# EasyEDA Pro project ProPrj_DRV8701电机双驱.epro

# Schematic Schematic1
Create Date: 2023-02-28; Page Name: P1; Project Name: DRV8701电机双驱; Schematic Name: Schematic1; Update Date: 2023-03-22; Company: 嘉立创EDA; Page Size: A4; Version: V1.0
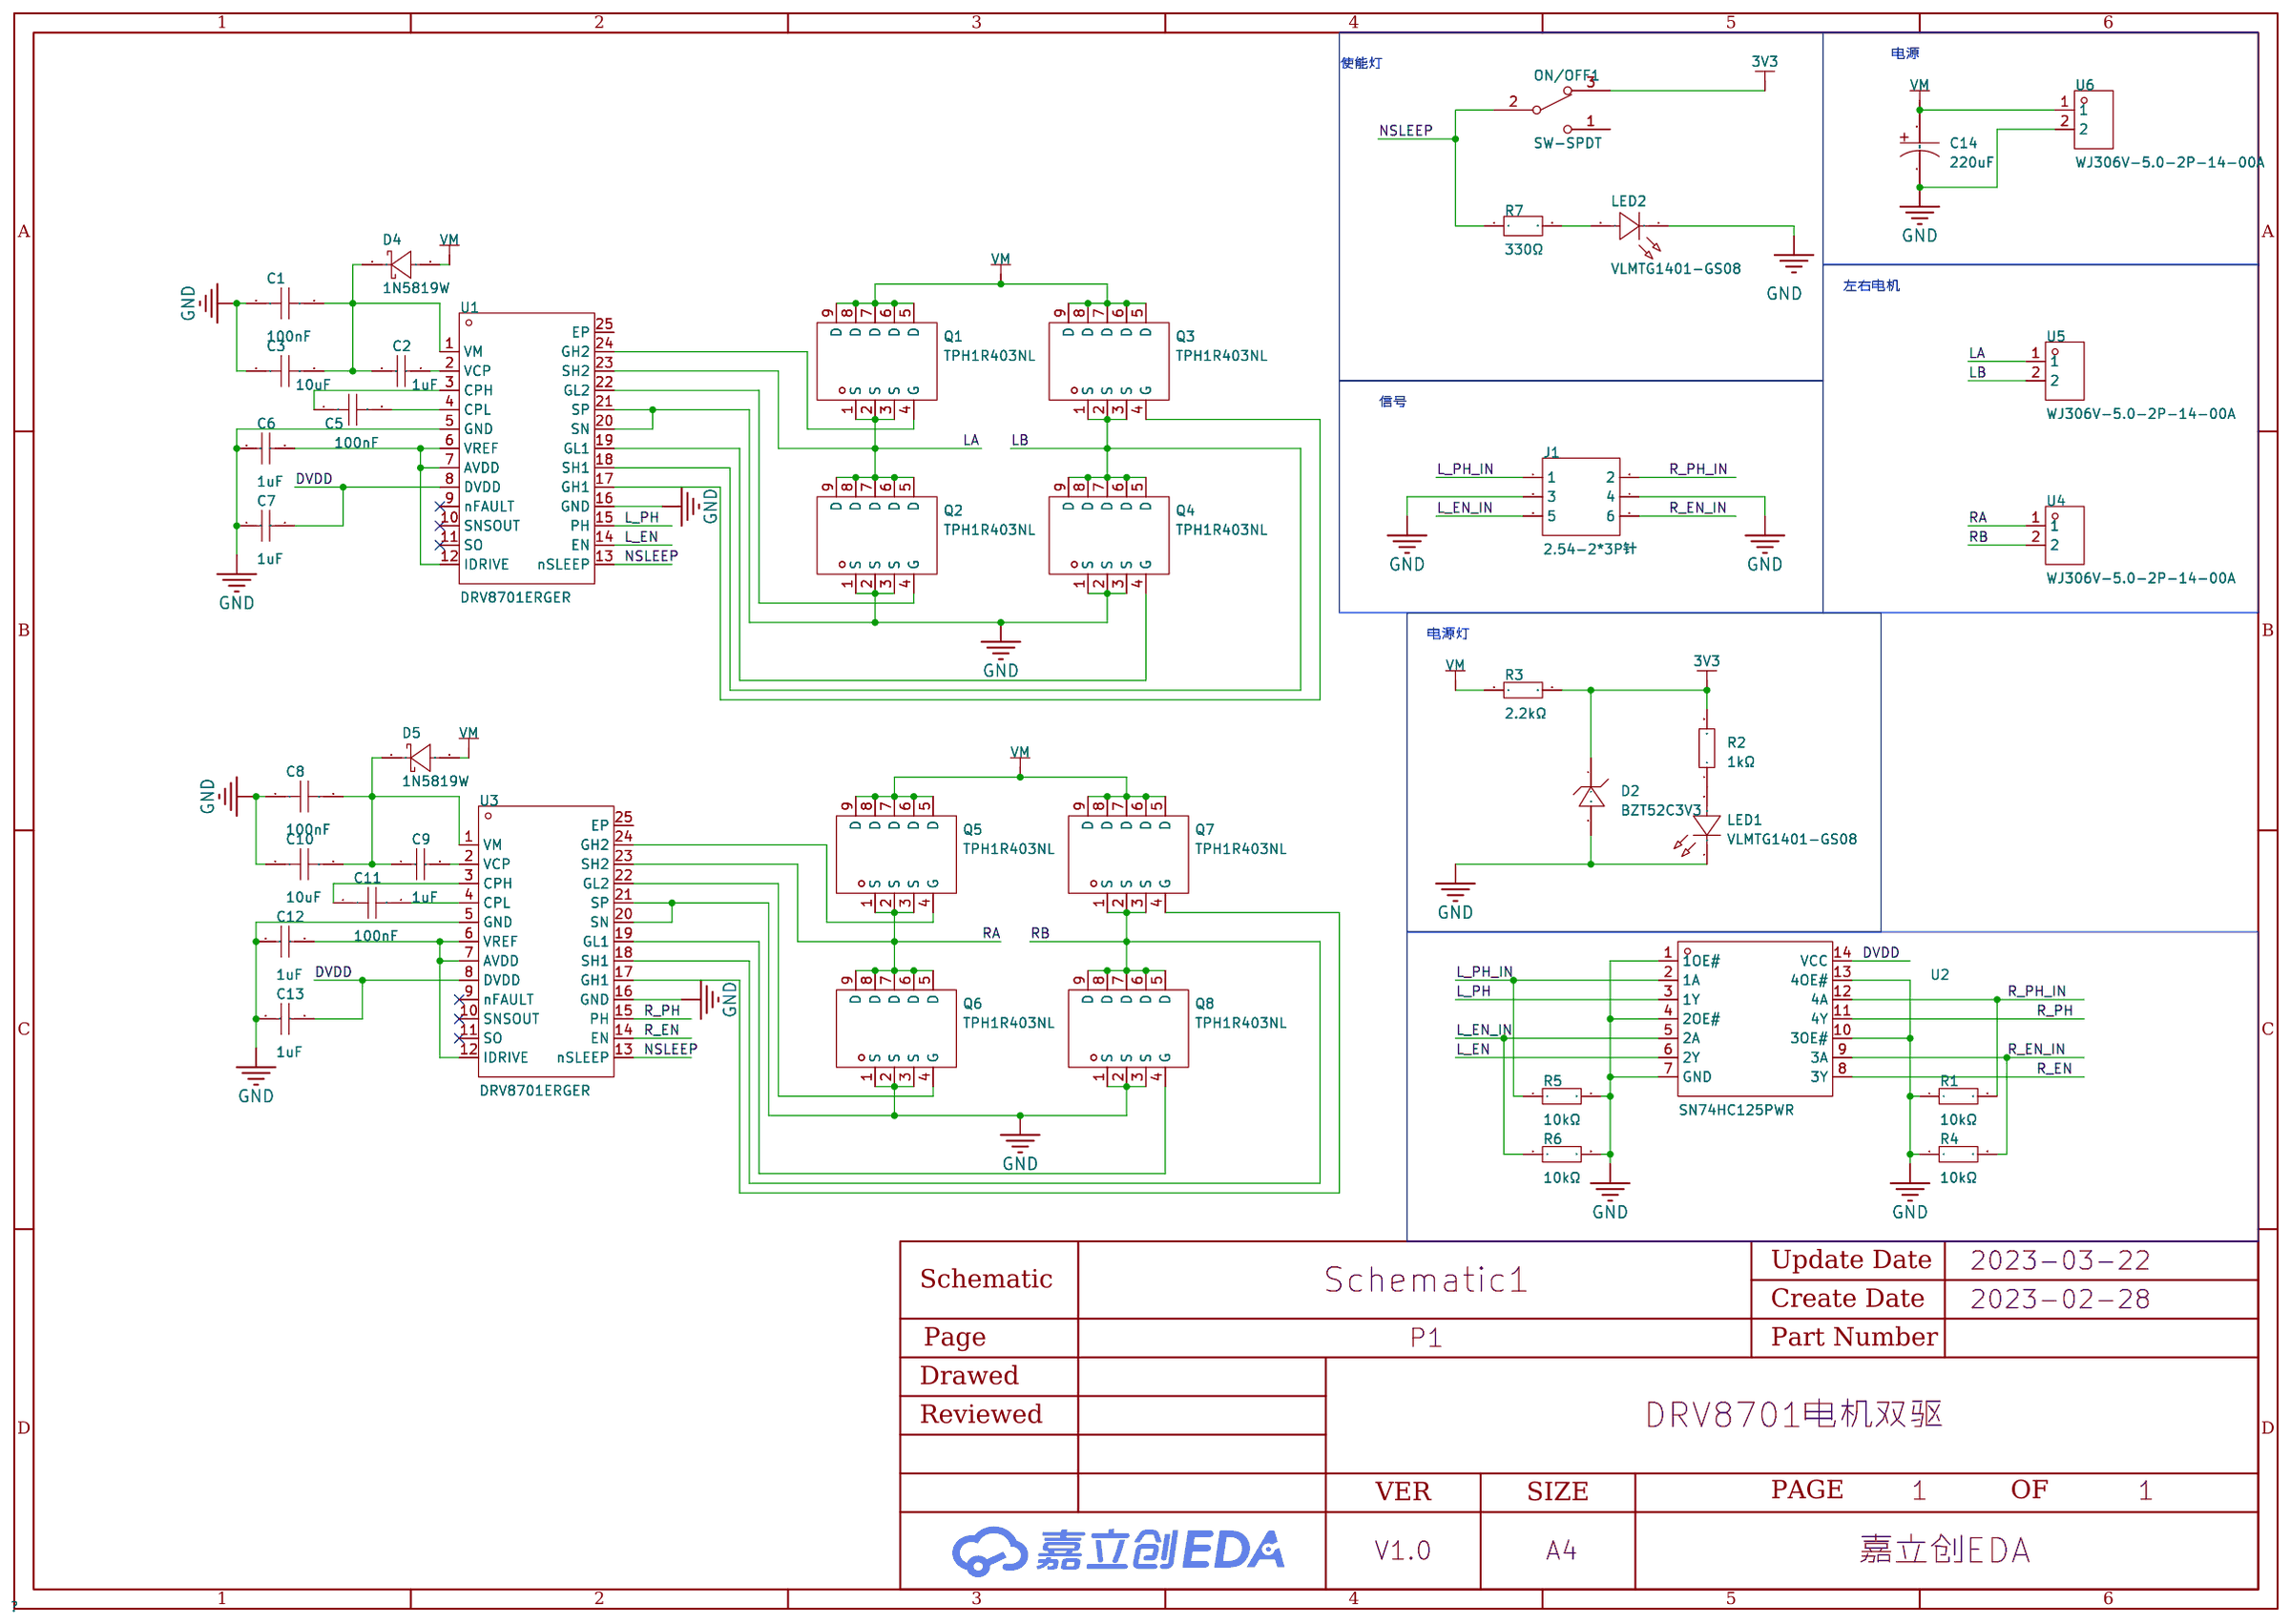
[diagram p0: schematic sheet]

## Parts
C1  100nF  [C0603]
C2  1uF  [C0603]
C3  10uF  [C0805]
C5  100nF  [C0603]
C6  1uF  [C0603]
C7  1uF  [C0603]
C8  100nF  [C0603]
C9  1uF  [C0603]
C10  10uF  [C0805]
C11  100nF  [C0603]
C12  1uF  [C0603]
C13  1uF  [C0603]
C14  220uF  [CAP-SMD_BD8.0-L8.3-W8.3-FD]
D2  BZT52C3V3  [SOD-123_L2.7-W1.6-LS3.7-RD-1]
D4  1N5819W  [SOD-123_L2.7-W1.6-LS3.7-RD-1]
D5  1N5819W  [SOD-123_L2.7-W1.6-LS3.7-RD-1]
J1  2.54-2*3P针  [HDR-TH_6P-P2.54-V-M-R2-C3-S2.54-1]
LED1  VLMTG1401-GS08  [LED0603-RD_GREEN]
LED2  VLMTG1401-GS08  [LED0603-RD_GREEN]
ON/OFF1  SW-SPDT  [SS12D10]
Q1  TPH1R403NL  [DSOP-8_L5.0-W5.0-P1.27-LS6.0-BL-EP]
Q2  TPH1R403NL  [DSOP-8_L5.0-W5.0-P1.27-LS6.0-BL-EP]
Q3  TPH1R403NL  [DSOP-8_L5.0-W5.0-P1.27-LS6.0-BL-EP]
Q4  TPH1R403NL  [DSOP-8_L5.0-W5.0-P1.27-LS6.0-BL-EP]
Q5  TPH1R403NL  [DSOP-8_L5.0-W5.0-P1.27-LS6.0-BL-EP]
Q6  TPH1R403NL  [DSOP-8_L5.0-W5.0-P1.27-LS6.0-BL-EP]
Q7  TPH1R403NL  [DSOP-8_L5.0-W5.0-P1.27-LS6.0-BL-EP]
Q8  TPH1R403NL  [DSOP-8_L5.0-W5.0-P1.27-LS6.0-BL-EP]
R1  10kΩ  [R0603]
R2  1kΩ  [R0603]
R3  2.2kΩ  [R0603]
R4  10kΩ  [R0603]
R5  10kΩ  [R0603]
R6  10kΩ  [R0603]
R7  330Ω  [R0603]
U1  DRV8701ERGER  [VQFN-24_L4.0-W4.0-P0.50-BL-EP2.5]
U2  SN74HC125PWR  [TSSOP-14_L5.0-W4.4-P0.65-LS6.5-BL]
U3  DRV8701ERGER  [VQFN-24_L4.0-W4.0-P0.50-BL-EP2.5]
U4  WJ306V-5.0-2P-14-00A  [CONN-TH_2P-P5.00_L7.6-W10.0]
U5  WJ306V-5.0-2P-14-00A  [CONN-TH_2P-P5.00_L7.6-W10.0]
U6  WJ306V-5.0-2P-14-00A  [CONN-TH_2P-P5.00_L7.6-W10.0]

## Library data of the parts
C1 C5 C8 C11 = CL10B104KB8NNNC: 容值:100nF;精度:±10%;额定电压:50V;材质(温度系数):X7R;; LCSC Part Name: 100nF ±10% 50V; Supplier Part: C1591; Manufacturer: SAMSUNG(三星); Supplier Footprint: 0603; JLCPCB Part Class: Extended Part; Datasheet: https://atta.szlcsc.com/upload/public/pdf/source/20160103/1457707680512.pdf; Supplier: LCSC; Tolerance: ±10%; Voltage Rated: 50V; Temperature Coefficient: X7R
C2 C6 C7 C9 C12 C13 = CL10A105KB8NNNC: 容值:1uF;精度:±10%;额定电压:50V;材质(温度系数):X5R;; LCSC Part Name: 1uF ±10% 50V; Supplier Part: C15849; Manufacturer: SAMSUNG(三星); Supplier Footprint: 0603; JLCPCB Part Class: Basic Part; Datasheet: https://atta.szlcsc.com/upload/public/pdf/source/20160103/1457707679084.pdf; Supplier: LCSC; Tolerance: ±10%; Voltage Rated: 50V; Temperature Coefficient: X5R
C3 C10 = CL21A106KBYQNNE: 容值:10uF;精度:±10%;额定电压:50V;材质(温度系数):X5R;; LCSC Part Name: 10uF ±10% 50V; Supplier Part: C2932476; Manufacturer: SAMSUNG(三星); Supplier Footprint: 0805; JLCPCB Part Class: Extended Part; Datasheet: https://atta.szlcsc.com/upload/public/pdf/source/20211217/EA547804C3DC63CB0E92325AB8B6CF61.pdf; Supplier: LCSC; Tolerance: ±10%; Voltage Rated: 50V; Temperature Coefficient: X5R
C14 = EEE1EA221UP: 容值:220uF;精度:±20%;额定电压:25V;电容体直径:8mm;电容体长度:10.2mm;纹波电流:-;等效串联电阻:-;工作寿命:2000hrs@85℃;工作温度:-40℃~+85℃;; LCSC Part Name: 220uF ±20% 25V; Supplier Part: C178503; Manufacturer: PANASONIC(松下); Supplier Footprint: SMD,8x10.2mm; JLCPCB Part Class: Extended Part; Datasheet: https://atta.szlcsc.com/upload/public/pdf/source/20180621/C178503_55EE803068FDE8BD2A71DBD57C7B88C8.pdf; Supplier: LCSC; Tolerance: ±20%; Rated Voltage: 25V; φD: 8mm; L: 10.2mm; Lifetime @ Temp: 2000hrs@85℃; Operating Temperature: -40℃~+85℃
D2 = BZT52C3V3: 二极管配置:-;稳压值(标称值):3.3V;稳压值(范围):3.3V~3.5V;功率:500mW;反向电流(Ir):5uA@1V;阻抗(Zzt):95Ω;; LCSC Part Name: 3.3V 500mW; Supplier Part: C2891770; Manufacturer: YONGYUTAI(永裕泰); Supplier Footprint: SOD-123; JLCPCB Part Class: Extended Part; Datasheet: https://atta.szlcsc.com/upload/public/pdf/source/20210901/8FC2376A01E96D0346FF8B134DC7A446.pdf; Supplier: LCSC; Zener Voltage (Nom): 3.3V; Zener Voltage (Range): 3.3V~3.5V; Power Dissipation: 500mW; Reverse Leakage Current (Ir): 5uA@1V; Zener Impedance (Zzt): 95Ω
D4 D5 = 1N5819W: 二极管配置:-;直流反向耐压(Vr):40V;平均整流电流(Io):1A;正向压降(Vf):900mV@3A;反向电流(Ir):1mA@40V;; LCSC Part Name: 40V 1A 900mV@3A; Supplier Part: C2905650; Manufacturer: TECH PUBLIC(台舟); Supplier Footprint: SOD-123; JLCPCB Part Class: Extended Part; Datasheet: https://atta.szlcsc.com/upload/public/pdf/source/20211020/7FEA34DA99E5285CBA3CC87767B82BE7.pdf; Supplier: LCSC; Reverse Voltage (Vr): 40V; Average Rectified Current (Io): 1A; Forward Voltage (Vf@If): 900mV@3A; Reverse Leakage Current (Ir): 1mA@40V
J1 = 2.54-2*3P针: 排数:双排;总PIN位数:6;间距:2.54mm;插针结构:-;行距:-;安装类型:直插;圆针/方针:-;额定电流:-;额定电压:-;配合针长度:-;塑高:-;触头材质:-;触头镀层:-;颜色:黑色;; LCSC Part Name: 2.54mm 直插; Supplier Part: C65114; Manufacturer: BOOMELE(博穆精密); Supplier Footprint: 插件,P=2.54mm; JLCPCB Part Class: Extended Part; Datasheet: https://atta.szlcsc.com/upload/public/pdf/source/20221201/C605E3BE9C0F7226363017EFD1BDE852.pdf; Supplier: LCSC; Number of Rows: 双排; Number of Pins: 6; Pitch: 2.54mm; Mounting Type: 直插; Color: 黑色
LED1 LED2 = VLMTG1401-GS08: 照明颜色:-;色温 - CCT（K）:-;主波长/色坐标:-;正向电压（Vf）:-;; Supplier Part: C511604; Manufacturer: VISHAY(威世); Supplier Footprint: 0603; JLCPCB Part Class: Extended Part; Datasheet: https://atta.szlcsc.com/upload/public/pdf/source/20200413/C511604_272E80EA2E53340B96FA7453D68B4387.pdf; Supplier: LCSC
ON/OFF1 = SW-SPDT: Published: 24-Mar-1999; Publisher: Altium Limited; Price(RMB): 0.000; Origin Footprint 2: ToggleSwitch 7102; Origin Footprint 3: SS12D06; Origin Footprint 4: SS12D07VG4; Origin Footprint 5: MSK-12C02
Q1-Q8 = TPH1R403NL_C83440: 类型:N沟道;漏源电压(Vdss):30V;连续漏极电流(Id):150A;功率(Pd):64W;导通电阻(RDS(on)@Vgs,Id):1.4mΩ@10V,30A;阈值电压(Vgs(th)@Id):2.3V@500uA;; LCSC Part Name: N沟道 30V 150A; Supplier Part: C83440; Manufacturer: TOSHIBA(东芝); Supplier Footprint: DSOP-8-EP-5.0mm; JLCPCB Part Class: Extended Part; Datasheet: https://atta.szlcsc.com/upload/public/pdf/source/20170908/C83440_1504870121708958077.pdf; Supplier: LCSC; Type: N沟道; Drain Source Voltage (Vdss): 30V; Continuous Drain Current (Id): 150A; Power Dissipation (Pd): 64W; Drain Source On Resistance (RDS(on)@Vgs,Id): 1.4mΩ@10V,30A; Gate Threshold Voltage (Vgs(th)@Id): 2.3V@500uA
R1 R4-R6 = 0603WAF1002T5E: 电阻类型:厚膜电阻;阻值:10kΩ;精度:±1%;功率:100mW;温度系数:±100ppm/℃;最大工作电压:75V;工作温度范围:-55℃~+155℃;; LCSC Part Name: 10kΩ ±1% 100mW; Supplier Part: C25804; Manufacturer: UNI-ROYAL(厚声); Supplier Footprint: 0603; JLCPCB Part Class: Basic Part; Datasheet: https://atta.szlcsc.com/upload/public/pdf/source/20200306/C422600_1E6D84923E4A46A82E41ADD87F860B5C.pdf; Supplier: LCSC; Type: 厚膜电阻; Tolerance: ±1%; Power(Watts): 100mW; Temperature Coefficient: ±100ppm/℃; Overload Voltage (Max): 75V; Operating Temperature Range: -55℃~+155℃
R2 = RC0603FR-071KL: 阻值:1kΩ;精度:±1%;功率:100mW;温度系数:±100ppm/℃;最大工作电压:75V;工作温度范围:-55℃~+155℃;; LCSC Part Name: 1kΩ ±1% 100mW; Supplier Part: C22548; Manufacturer: YAGEO(国巨); Supplier Footprint: 0603; JLCPCB Part Class: Extended Part; Datasheet: https://atta.szlcsc.com/upload/public/pdf/source/20180312/7BD3618A8B6324EA6280B0497A051AB7.pdf; Supplier: LCSC; Tolerance: ±1%; Power(Watts): 100mW; Temperature Coefficient: ±100ppm/℃; Overload Voltage (Max): 75V; Operating Temperature Range: -55℃~+155℃
R3 = ERA3AEB222V: 电阻类型:薄膜电阻;阻值:2.2kΩ;精度:±0.1%;功率:100mW;温度系数:±25ppm/K;最大工作电压:75V;工作温度范围:-55℃~+155℃;; LCSC Part Name: 2.2kΩ ±0.1% 100mW; Supplier Part: C445630; Manufacturer: PANASONIC(松下); Supplier Footprint: 0603; JLCPCB Part Class: Extended Part; Supplier: LCSC; Type: 薄膜电阻; Tolerance: ±0.1%; Power(Watts): 100mW; Temperature Coefficient: ±25ppm/K; Overload Voltage (Max): 75V; Operating Temperature Range: -55℃~+155℃
R7 = ERJ3GEYJ331V: 电阻类型:厚膜电阻;阻值:330Ω;精度:±5%;功率:100mW;温度系数:±200ppm/℃;最大工作电压:-;工作温度范围:-55℃~+155℃;; LCSC Part Name: 330Ω ±5% 100mW; Supplier Part: C403479; Manufacturer: PANASONIC(松下); Supplier Footprint: 0603; JLCPCB Part Class: Extended Part; Datasheet: https://atta.szlcsc.com/upload/public/pdf/source/20190709/C403479_A3D566F20913506783C3BF31489EE7BE.pdf; Supplier: LCSC; Type: 厚膜电阻; Tolerance: ±5%; Power(Watts): 100mW; Temperature Coefficient: ±200ppm/℃; Operating Temperature Range: -55℃~+155℃
U1 U3 = DRV8701ERGER: DRV8701 DRV8701 H 桥栅极驱动器; Supplier Part: C90964; Manufacturer: TI(德州仪器); Supplier Footprint: VQFN-24; JLCPCB Part Class: Extended Part; Datasheet: https://atta.szlcsc.com/upload/public/pdf/source/20190902/C90964_2DCC43C1A4AE58E3ED96296E8C78517C.pdf; Supplier: LCSC; Type: 有刷直流电机; Supply Voltage: 0V~5.5V; Interface: 并行; Operating Temperature: -40℃~+125℃@(Ta)
U2 = SN74HC125PWR: 类型:缓冲器，非反相;电源电压:2V~6V;输入类型:-;输出类型:三态;低电平输出电流(IOL):7.8mA;高电平输出电流(IOH):7.8mA;工作温度:-40℃~+85℃;; Supplier Part: C132994; Manufacturer: TI(德州仪器); Supplier Footprint: TSSOP-14; JLCPCB Part Class: Extended Part; Datasheet: https://atta.szlcsc.com/upload/public/pdf/source/20170930/C132994_1506736365150997346.pdf; Supplier: LCSC; Type: 缓冲器，非反相; Supply Voltage: 2V~6V; output type: 三态; Current-OutputLow: 7.8mA; Current-OutputHigh: 7.8mA; Operating temperature: -40℃~+85℃
U4-U6 = WJ306V-5.0-2P-14-00A: LCSC Part Name: 接线端子 直插式/5.0mm 4P 绿色; Supplier Part: C3031443; Manufacturer: KANGNEX(康奈克斯电气); Supplier Footprint: P=5.0mm; JLCPCB Part Class: Extended Part; Datasheet: https://atta.szlcsc.com/upload/public/pdf/source/20220629/C58904DE4C7373837BBB74E73B3FE59B.pdf; Supplier: LCSC

## Nets
3V3: D2.1 ON/OFF1.3 R2.2 R3.2
DVDD: C7.2 C13.2 U1.8(DVDD) U2.14(VCC) U3.8(DVDD)
GND: C1.1 C3.1 C6.1 C7.1 C8.1 C10.1 C12.1 C13.1 C14.2 D2.2 J1.3 J1.4 LED1.1(K) LED2.1(K) Q2.1(S) Q2.2(S) Q2.3(S) Q4.1(S) Q4.2(S) Q4.3(S) Q6.1(S) Q6.2(S) Q6.3(S) Q8.1(S) Q8.2(S) Q8.3(S) R1.1 R4.1 R5.2 R6.2 U1.5(GND) U1.16(GND) U1.20(SN) U1.21(SP) U2.1(1OE#) U2.4(2OE#) U2.7(GND) U2.10(3OE#) U2.13(4OE#) U3.5(GND) U3.16(GND) U3.20(SN) U3.21(SP) U6.2
L_EN: U1.14(EN) U2.6(2Y)
L_EN_IN: J1.5 R6.1 U2.5(2A)
L_PH: U1.15(PH) U2.3(1Y)
L_PH_IN: J1.1 R5.1 U2.2(1A)
LA: Q1.1(S) Q1.2(S) Q1.3(S) Q2.5(D) Q2.6(D) Q2.7(D) Q2.8(D) Q2.9(D) U1.23(SH2) U5.1
LB: Q3.1(S) Q3.2(S) Q3.3(S) Q4.5(D) Q4.6(D) Q4.7(D) Q4.8(D) Q4.9(D) U1.18(SH1) U5.2
NSLEEP: ON/OFF1.2 R7.1 U1.13(nSLEEP) U3.13(nSLEEP)
R_EN: U2.8(3Y) U3.14(EN)
R_EN_IN: J1.6 R4.2 U2.9(3A)
R_PH: U2.11(4Y) U3.15(PH)
R_PH_IN: J1.2 R1.2 U2.12(4A)
RA: Q5.1(S) Q5.2(S) Q5.3(S) Q6.5(D) Q6.6(D) Q6.7(D) Q6.8(D) Q6.9(D) U3.23(SH2) U4.1
RB: Q7.1(S) Q7.2(S) Q7.3(S) Q8.5(D) Q8.6(D) Q8.7(D) Q8.8(D) Q8.9(D) U3.18(SH1) U4.2
VM: C14.1 D4.2(A) D5.2(A) Q1.5(D) Q1.6(D) Q1.7(D) Q1.8(D) Q1.9(D) Q3.5(D) Q3.6(D) Q3.7(D) Q3.8(D) Q3.9(D) Q5.5(D) Q5.6(D) Q5.7(D) Q5.8(D) Q5.9(D) Q7.5(D) Q7.6(D) Q7.7(D) Q7.8(D) Q7.9(D) R3.1 U6.1
$1N2144: Q1.4(G) U1.24(GH2)
$1N2211: Q2.4(G) U1.22(GL2)
$1N2235: Q4.4(G) U1.19(GL1)
$1N2246: Q3.4(G) U1.17(GH1)
$1N2287: C2.2 U1.2(VCP)
$1N2321: C5.2 U1.4(CPL)
$1N2324: C5.1 U1.3(CPH)
$1N2619: C6.2 U1.6(VREF) U1.7(AVDD) U1.12(IDRIVE)
$1N3409: Q5.4(G) U3.24(GH2)
$1N3414: Q6.4(G) U3.22(GL2)
$1N3434: Q8.4(G) U3.19(GL1)
$1N3439: Q7.4(G) U3.17(GH1)
$1N3449: C9.2 U3.2(VCP)
$1N3451: C11.2 U3.4(CPL)
$1N3453: C11.1 U3.3(CPH)
$1N3466: C12.2 U3.6(VREF) U3.7(AVDD) U3.12(IDRIVE)
$1N3933: LED1.2(A) R2.1
$1N4439: LED2.2(A) R7.2
$1N4849: C1.2 C2.1 C3.2 D4.1(K) U1.1(VM)
$1N4857: C8.2 C9.1 C10.2 D5.1(K) U3.1(VM)

Not connected (* = marked no-connect by the designer): ON/OFF1 1; U1 9(nFAULT)* 10(SNSOUT)* 11(SO)* 25(EP); U3 9(nFAULT)* 10(SNSOUT)* 11(SO)* 25(EP)

## Notes on the sheet
- 电源
- 使能灯
- 左右电机
- 信号
- 电源灯

# Board PCB1
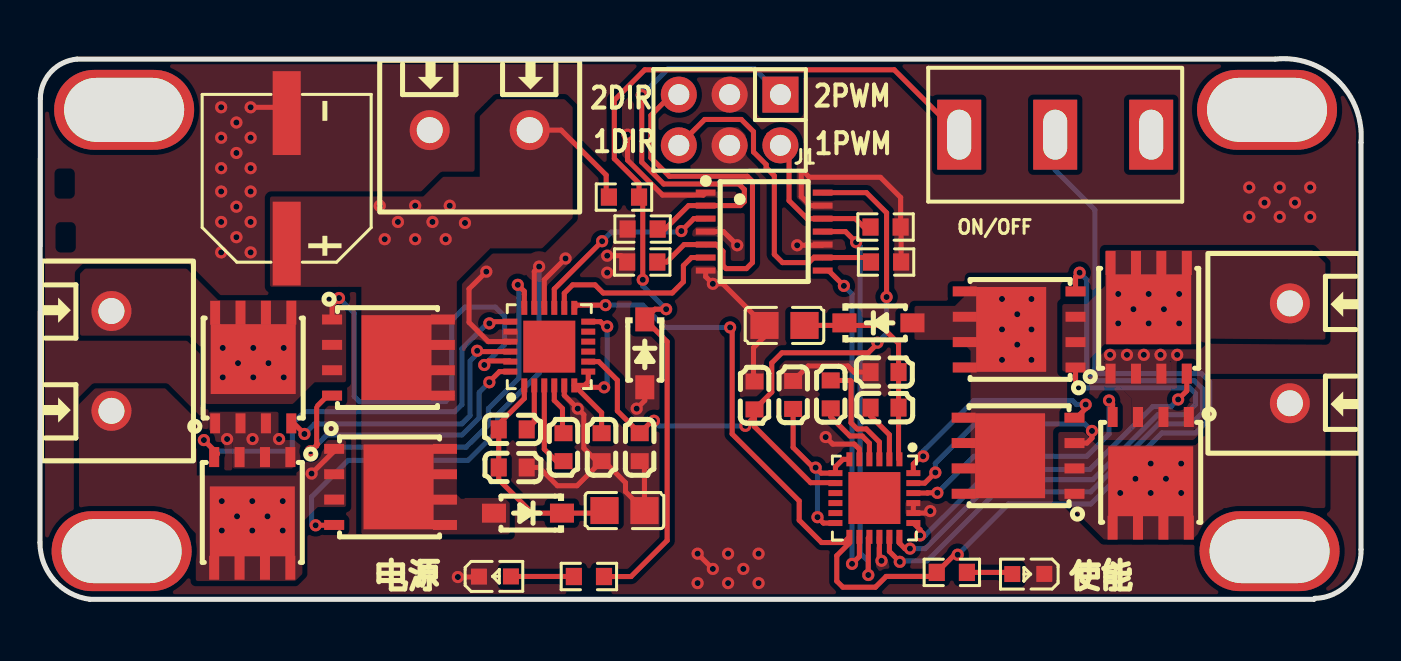
[diagram p1: board, top side]
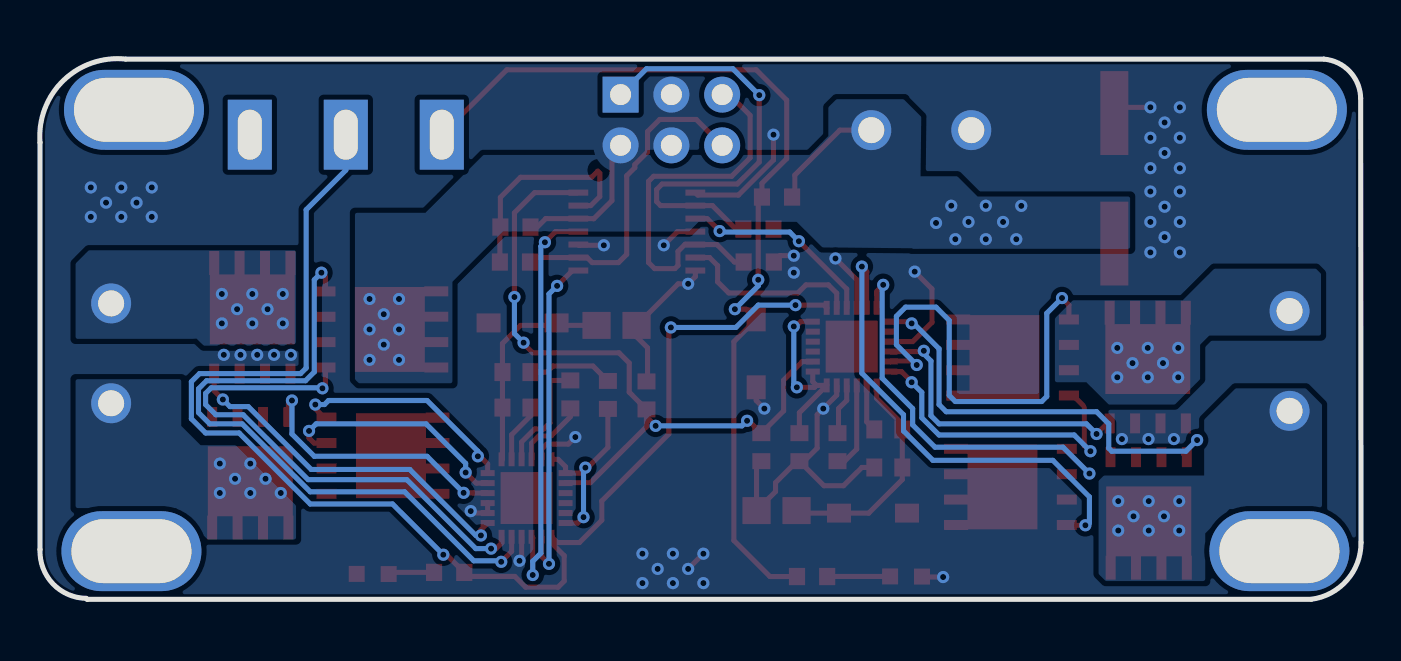
[diagram p2: board, bottom side, seen from below]

Outline 66.06 x 27.05 mm; copper layers: Top Layer, Bottom Layer. Coordinates in mm from the lower left corner of the outline.
Outline path: 0,2.83 0.02,25.08 arc(0.56,26.42) 1.85,27.05 61.77,27.05 arc(64.89,25.97) 66.06,22.88 66.06,2.48 arc(65.41,0.78) 63.75,0.05 63.7,0 2.49,0 arc(0.71,0.94) 0,2.83
Stack: Top Layer 0.035mm / Dielectric1 1.51mm FR4 er 4.5 / Bottom Layer 0.035mm

## Design rules (mm)
template: 自定义配置
spacing copperThickness1oz (default): track to track 0.102, other pairs 0.152 to 0.3
spacing copperThickness2oz: track to track 0.203, other pairs 0.152 to 0.3
track width copperThickness1oz (default): min 0.127, default 0.254, max 2.54
track width copperThickness2oz: min 0.203, default 0.254, max 2.54
differential pair differentialPair (default): width min 0.127, default 0.254, max 2.54; gap min 0.152, default 0.152
via viaSize (default): diameter min 0.5, default 0.61, max 10; hole min 0.3, default 0.305, max 6.3

## Placement (name value [footprint] x y rotation side)
C1  100nF  [C0603]  23.64 6.6 180 top
C2  1uF  [C0603]  23.64 8.51 0 top
C3  10uF  [C0805]  29.23 4.44 180 top
C5  100nF  [C0603]  26.18 7.62 90 top
C6  1uF  [C0603]  28.08 7.62 90 top
C7  1uF  [C0603]  29.99 7.62 90 top
C8  100nF  [C0603]  42.23 11.38 0 top
C9  1uF  [C0603]  42.23 9.6 180 top
C10  10uF  [C0805]  37.23 13.71 0 top
C11  100nF  [C0603]  39.54 10.26 270 top
C12  1uF  [C0603]  37.66 10.23 270 top
C13  1uF  [C0603]  35.73 10.21 270 top
C14  220uF  [CAP-SMD_BD8.0-L8.3-W8.3-FD]  12.34 21.08 90 top
D2  BZT52C3V3  [SOD-123_L2.7-W1.6-LS3.7-RD-1]  30.24 12.32 270 top
D4  1N5819W  [SOD-123_L2.7-W1.6-LS3.7-RD-1]  24.4 4.32 180 top
D5  1N5819W  [SOD-123_L2.7-W1.6-LS3.7-RD-1]  41.93 13.84 0 top
J1  2.54-2*3P针  [HDR-TH_6P-P2.54-V-M-R2-C3-S2.54-1]  34.49 24 180 top
LED1  VLMTG1401-GS08  [LED0603-RD_GREEN]  22.75 1.14 0 top
LED2  VLMTG1401-GS08  [LED0603-RD_GREEN]  49.42 1.27 180 top
NOREF  -  [Pad_e208]  4.21 24.51 0 top
NOREF#2  -  [Pad_e207]  4.08 2.41 0 top
NOREF#3  -  [Pad_e200]  61.36 24.51 0 top
NOREF#4  -  [Pad_e206]  61.49 2.41 0 top
ON/OFF  SW-SPDT  [SS12D10]  50.77 23.26 180 top
Q1  TPH1R403NL  [DSOP-8_L5.0-W5.0-P1.27-LS6.0-BL-EP]  17.38 12.1 270 top
Q2  TPH1R403NL  [DSOP-8_L5.0-W5.0-P1.27-LS6.0-BL-EP]  10.66 11.58 0 top
Q3  TPH1R403NL  [DSOP-8_L5.0-W5.0-P1.27-LS6.0-BL-EP]  17.48 5.63 270 top
Q4  TPH1R403NL  [DSOP-8_L5.0-W5.0-P1.27-LS6.0-BL-EP]  10.62 4.35 180 top
Q5  TPH1R403NL  [DSOP-8_L5.0-W5.0-P1.27-LS6.0-BL-EP]  48.96 7.19 90 top
Q6  TPH1R403NL  [DSOP-8_L5.0-W5.0-P1.27-LS6.0-BL-EP]  55.54 6.36 180 top
Q7  TPH1R403NL  [DSOP-8_L5.0-W5.0-P1.27-LS6.0-BL-EP]  49.01 13.51 90 top
Q8  TPH1R403NL  [DSOP-8_L5.0-W5.0-P1.27-LS6.0-BL-EP]  55.44 14.07 0 top
R1  10kΩ  [R0603]  42.28 18.64 180 top
R2  1kΩ  [R0603]  27.45 1.14 0 top
R3  2.2kΩ  [R0603]  29.2 20.14 0 top
R4  10kΩ  [R0603]  42.31 16.89 180 top
R5  10kΩ  [R0603]  30.13 18.54 180 top
R6  10kΩ  [R0603]  30.12 16.89 180 top
R7  330Ω  [R0603]  45.6 1.35 0 top
U1  DRV8701ERGER  [VQFN-24_L4.0-W4.0-P0.50-BL-EP2.5]  25.47 12.65 0 top
U2  SN74HC125PWR  [TSSOP-14_L5.0-W4.4-P0.65-LS6.5-BL]  36.21 18.41 270 top
U3  DRV8701ERGER  [VQFN-24_L4.0-W4.0-P0.50-BL-EP2.5]  41.72 5.07 180 top
U4  WJ306V-5.0-2P-14-00A  [CONN-TH_2P-P5.00_L7.6-W10.0]  62.5 12.32 90 top
U5  WJ306V-5.0-2P-14-00A  [CONN-TH_2P-P5.00_L7.6-W10.0]  3.57 11.94 270 top
U6  WJ306V-5.0-2P-14-00A  [CONN-TH_2P-P5.00_L7.6-W10.0]  21.99 23.49 180 top

## Footprints (pads in the part's own frame, mm; a bottom-side part is the same pattern mirrored in y, then rotated)
C0603
  rect 0.8x0.9 smd: 1(-0.7,0) 2(0.7,0)
C0805
  rect 1.41x1.35 smd: 1(-1,0) 2(1,0)
CAP-SMD_BD8.0-L8.3-W8.3-FD
  rect 4.2x1.4 smd: 1(-3.267,0) 2(3.267,0)
CONN-TH_2P-P5.00_L7.6-W10.0
  round 2 hole 1.3: 1(-2.5,0) 2(2.5,0)
DSOP-8_L5.0-W5.0-P1.27-LS6.0-BL-EP
  rect 0.5x1 smd: 1(-1.905,-2.77) 2(-0.635,-2.77) 3(0.634,-2.77) 4(1.905,-2.77)
  rect 0.5x1.2 smd: 5(1.905,2.77) 6(0.635,2.77) 7(-0.634,2.77) 8(-1.905,2.77)
  custom 4.25x3.5 smd: 9(0,0.45)
HDR-TH_6P-P2.54-V-M-R2-C3-S2.54-1
  rect 1.8x1.8 hole 1.05: 1(-2.54,-1.27)
  round 1.8 hole 1.05: 2(-2.54,1.27) 3(0,-1.27) 4(0,1.27) 5(2.54,-1.27) 6(2.54,1.27)
LED0603-RD_GREEN
  rect 0.8x0.8 smd: 1(-0.799,-0.004) 2(0.799,0.004)
Pad_e200
  oval 7x4 hole 6x3.2: 1(0,0)
Pad_e206
  oval 7x4 hole 6x3.2: 1(0,0)
Pad_e207
  oval 7x4 hole 6x3.2: 1(0,0)
Pad_e208
  oval 7x4 hole 6x3.2: 1(0,0)
R0603
  rect 0.806x0.864 smd: 1(-0.753,0) 2(0.753,0)
SOD-123_L2.7-W1.6-LS3.7-RD-1
  rect 1.2x0.95 smd: 1(-1.7,0) 2(1.7,0)
SS12D10
  rect 2.2x3.5 hole 1.2x2.5: 1(-4.8,0) 2(0,0) 3(4.8,0)
TSSOP-14_L5.0-W4.4-P0.65-LS6.5-BL
  rect 0.305x0.991 smd: 1(-1.95,-2.925) 2(-1.3,-2.925) 3(-0.65,-2.925) 4(0,-2.925) 5(0.65,-2.925) 6(1.3,-2.925) 7(1.95,-2.925) 8(1.95,2.925) 9(1.3,2.925) 10(0.65,2.925) 11(0,2.925) 12(-0.65,2.925) 13(-1.3,2.925) 14(-1.95,2.925)
VQFN-24_L4.0-W4.0-P0.50-BL-EP2.5
  rect 0.3x0.7 smd: 1(-1.25,-1.942) 2(-0.75,-1.942) 3(-0.25,-1.942) 4(0.25,-1.942) 5(0.75,-1.942) 6(1.25,-1.942) 13(1.25,1.942) 14(0.75,1.942) 15(0.25,1.942) 16(-0.25,1.942) 17(-0.75,1.942) 18(-1.25,1.942)
  rect 0.7x0.3 smd: 7(1.948,-1.25) 8(1.948,-0.75) 9(1.948,-0.25) 10(1.948,0.25) 11(1.948,0.75) 12(1.948,1.25) 19(-1.948,1.25) 20(-1.948,0.75) 21(-1.948,0.25) 22(-1.948,-0.25) 23(-1.948,-0.75) 24(-1.948,-1.25)
  rect 2.6x2.6 smd: 25(0.001,-0.001)

## Nets
As in the schematic, except:
3V3: D2.1 ON/OFF.3 R2.2 R3.2
NSLEEP: ON/OFF.2 R7.1 U1.13 U3.13

Pads without a net: NOREF 1; NOREF#2 1; NOREF#3 1; NOREF#4 1; ON/OFF 1; U1 9 10 11 25; U3 9 10 11 25

## Via types
v1: diameter 0.61, hole 0.305, Top Layer to Bottom Layer, 146 vias

## Routing (per net, layer and track width the routed paths; a pad name or vN(x,y) marks a point on that pad's centre or on a via; arc(x,y) is an arc through that point)
3V3: length 47.5
  Top Layer w0.254: v1(30.14,16) 30.14,19.95 R3.2 29.96,20.83 28.72,22.06 28.72,24.99 30.24,26.52 42.71,26.52 ON/OFF.3 ; v1(31.31,14.53) 30.75,14.53 D2.1 31.36,12.9 31.36,2.94 29.56,1.14 R2.2
  Bottom Layer w0.254: v1(30.14,16) 30.14,15.7 v1(31.31,14.53)
DVDD: length 36
  Top Layer w0.254: U3.8 39.76,5.84 38.53,5.84 35.73,8.65 35.73,9.14 ; 35.37,8.74 35.37,8.79 35.73,9.14 ; v1(41.88,12.85) 41.88,12.8 41.42,12.34 37.1,12.34 36.59,11.83 36.59,10.37 C13.2 35.73,9.14 ; 39.14,20.36 41.32,20.36 42.33,19.35 v1(42.33,15.14) ; v1(30.7,8.94) 30.61,8.94 C7.2 28.87,9.44 28.87,10.97 27.94,11.9 27.42,11.9
  Bottom Layer w0.254: v1(30.7,8.94) 30.95,8.69 v1(35.27,8.69) ; v1(41.88,12.85) 42.33,13.31 v1(42.33,15.14)
GND: length 67
  Top Layer w0.254: U2.10 39.1,17.73 v1(37.86,17.73) ; 39.18,8.23 39.64,7.77 40.72,7.77 40.97,7.52 U3.5 ; C8.1 40.71,11.38 40.4,11.68 38.41,11.68 C12.1 ; 33.29,20.36 33.17,20.24 31.13,20.24 29.38,21.99 v1(29.38,23.26) ; LED1.1 21.93,1.12 v1(20.9,1.12) ; U1.21 22.42,12.9 21.45,13.87 21.45,15.54 v1(22.32,16.41) ; C6.1 28.2,6.92 29.28,5.84 29.28,5.39 C3.1 30.23,6.68 C7.1 ; C6.1 26.85,5.69 25.87,5.69 24.96,6.6 C1.1 ; C6.1 27.84,6.92 27.2,7.57 27.2,9.24 v1(26.89,9.55) 26.22,10.22 U1.5 ; C14.2 12.05,24.64 v1(10.53,24.64) ; D2.2 30.24,9.95 v1(29.84,9.55) ; v1(26.28,17.07) 25.22,16 U1.16 ; U3.16 41.97,2.08 ; U2.7 33.29,16.16 v1(33.65,15.8) 34.15,15.8 C10.1 36.23,13.15 35.68,12.6 35.68,10.91 ; U3.21 U3.20 44.42,4.32 v1(44.52,4.42) ; v1(34.87,17.73) 34.18,18.41 U2.4 ; R4.1 43.06,18.62 R1.1 43.04,20.12 42.03,21.13 38.47,21.13 38.17,21.44 38.07,21.33 38.07,20.17 38.52,19.71 U2.13 ; v1(32.88,2.28) v1(33.65,1.52) ; v1(28.36,17.21) 29.05,17.21 R6.2
  vias: v1(9.06,24.64) v1(9.06,23.11) v1(9.06,21.59) v1(9.06,20.42) v1(9.06,18.9) v1(9.06,17.37) v1(9.36,8.02) v1(9.82,23.87) v1(9.82,22.35) v1(9.82,19.66) v1(9.82,18.13) v1(10.53,23.11) v1(10.53,21.59) v1(10.53,20.42) v1(10.53,18.9) v1(10.53,17.37) v1(10.63,8.02) v1(11.96,8.02) v1(28.36,16.36) v1(32.88,0.81) v1(34.41,2.28) v1(34.41,0.81) v1(35.17,1.52) v1(35.93,2.28) v1(35.93,0.81) v1(39.29,8.12) v1(42.08,1.93) v1(53.51,12.24) v1(54.35,12.24) v1(55.2,12.24) v1(56.03,12.24) v1(56.87,12.24) v1(60.47,20.62) v1(60.47,19.15) v1(61.23,19.86) v1(61.99,20.62) v1(61.99,19.15) v1(62.76,19.86) v1(63.52,20.62) v1(63.52,19.15)
L_EN: length 9.4
  Top Layer w0.254: U1.14 26.22,15.33 26.64,15.75 27.75,15.75 28.16,15.34 31.61,15.34 32.17,15.9 32.17,16.71 32.58,17.11 U2.6
L_EN_IN: length 20.3
  Top Layer w0.254: R6.1 31.34,16.89 32.21,17.76 U2.5 33.78,17.76 33.8,17.78 34.16,17.42 34.16,16.71 34.31,16.56 35.32,16.56 35.63,16.86 35.63,20.93 35.37,21.18 31.47,21.18 30.55,22.11 30.55,24.23 32.25,25.93
L_PH: length 10
  Top Layer w0.254: 33.29,19.06 32.7,19.06 v1(32.07,18.44) ; U1.15 25.72,15.54 v1(28.11,17.93)
  Bottom Layer w0.254: v1(28.11,17.93) 28.57,18.39 32.07,18.39 v1(32.07,18.44)
L_PH_IN: length 22.6
  Top Layer w0.254: R5.1 31.26,18.54 32.43,19.71 U2.2 35.02,19.71 35.22,19.91 35.22,20.52 34.95,20.79 31.19,20.79 30.09,21.89 v1(30.09,25.25)
  Bottom Layer w0.254: v1(30.09,25.25) 31.41,26.57 35.73,26.57 J1.1
LA: length 22.7
  Top Layer w0.254: 23.52,11.9 23.49,11.94 22.42,11.94 v1(22.22,11.73) ; Q1.1 14.61,14.74 v1(14.95,15.09)
  Bottom Layer w0.254: v1(14.95,15.09) 15.71,14.32 15.71,10.16 15.97,9.9 20.29,9.9 20.59,10.21 20.59,13.97 21.25,14.63 22.78,14.63 23.23,14.17 23.23,12.75 v1(22.22,11.73)
  vias: v1(9.14,12.59) v1(9.14,11.12) v1(9.9,11.83) v1(10.66,12.59) v1(10.66,11.12) v1(11.43,11.83) v1(12.19,12.59) v1(12.19,11.12)
LB: length 20.5
  Top Layer w0.254: v1(23.89,15.75) 24.22,15.42 U1.18 ; v1(13.58,6.3) 14.64,7.36 14.64,7.47 Q3.1
  Bottom Layer w0.254: v1(23.89,15.75) 23.94,15.7 23.94,11.07 22.42,9.55 22.42,8.74 21.3,7.62 14.9,7.62 v1(13.58,6.3)
  vias: v1(9.09,4.92) v1(9.09,3.44) v1(9.85,4.16) v1(10.62,4.92) v1(10.62,3.44) v1(11.38,4.16) v1(12.14,4.92) v1(12.14,3.44)
NSLEEP: length 67.4
  Top Layer w0.254: v1(45.89,2.23) 45.73,2.23 R7.1 44.64,1.15 42.31,1.15 41.78,0.61 40.15,0.61 39.84,0.91 39.84,2.18 40.47,2.81 U3.13 40.19,2.84 39.08,2.84 37.97,3.96 37.97,4.93 34.61,8.28 34.61,13.51 v1(34.51,13.61) ; 28.11,14.73 26.85,14.73 U1.13
  Bottom Layer w0.254: ON/OFF.2 50.77,21.49 52.75,19.51 52.75,11.58 53.03,11.3 58.08,11.3 58.49,10.89 58.49,9.04 57.78,8.33 56.1,8.33 52.54,4.77 48.43,4.77 v1(45.89,2.23) ; v1(34.51,13.61) 31.26,13.61 30.14,14.73 v1(28.28,14.73)
R_EN: length 17
  Top Layer w0.254: v1(40.2,15.7) 39.43,16.46 U2.8 ; v1(40.61,1.78) 40.97,2.14 U3.14
  Bottom Layer w0.254: v1(40.2,15.7) 40.61,15.29 v1(40.61,1.78)
R_EN_IN: length 16
  Top Layer w0.254: 41.3,17.11 U2.9 38.7,17.11 38.44,16.86 37.13,16.86 36.72,17.27 36.72,21.21 36.31,21.61 36.31,21.77 35.68,22.4 35.68,23.42 35.07,24.03 33.24,24.03 J1.6
R_PH: length 20.7
  Top Layer w0.254: v1(41.42,1.22) 41.42,3.07 U3.15 ; v1(40.81,17.88) 40.28,18.41 U2.11
  Bottom Layer w0.254: v1(40.81,17.88) 41.01,17.68 41.01,2.31 41.42,1.9 v1(41.42,1.22)
R_PH_IN: length 8.2
  Top Layer w0.254: 38.37,19.06 40.77,19.06 41.29,18.54 41.3,18.54 ; 36.43,23.26 37.46,22.23 37.46,19.96 38.37,19.05
RA: length 12
  Top Layer w0.254: v1(52.6,8.43) 52.6,8.08 52.35,7.82 51.73,7.82 ; 44.72,6.45 44.77,6.4 v1(44.77,6.35) 44.24,5.82 U3.23
  Bottom Layer w0.254: v1(44.77,6.35) 44.77,6.81 46.75,8.79 52.25,8.79 v1(52.6,8.43)
  vias: v1(54.02,5.32) v1(54.78,6.04) v1(55.54,6.8) v1(55.54,5.32) v1(56.3,6.04) v1(57.07,6.8) v1(57.07,5.32)
RB: length 25.9
  Top Layer w0.254: v1(51.94,10.56) 51.78,10.56 Q7.1 ; v1(43.5,2.54) 43.25,2.54 42.97,2.81 U3.18
  Bottom Layer w0.254: v1(43.5,2.54) 44.26,2.54 47.72,5.99 52.65,5.99 55.9,9.24 57.27,9.24 57.78,9.75 57.78,10.31 57.5,10.59 51.96,10.59 v1(51.94,10.56)
  vias: v1(53.92,15.29) v1(53.92,13.82) v1(54.68,14.53) v1(55.44,15.29) v1(55.44,13.82) v1(56.2,14.53) v1(56.96,15.29) v1(56.96,13.82)
VM: length 5.9
  Top Layer w0.254: U6.1 26.06,23.49 28.31,21.24 28.31,20.14
  vias: v1(16.99,19.7) v1(17.24,18.03) v1(17.9,18.9) v1(18.76,19.71) v1(18.76,18.03) v1(19.63,18.9) v1(20.29,18.03) v1(20.49,19.71) v1(21.25,18.84) v1(48.11,15.04) v1(48.11,13.51) v1(48.11,11.99) v1(48.87,14.28) v1(48.87,12.75) v1(49.58,15.04) v1(49.58,13.51) v1(49.58,11.99)
$1N2144: length 15.8
  Top Layer w0.254: 13.83,7.72 13.83,9.6 ; 13.83,7.72 13.83,7.67 ; 13.83,7.72 13.89,7.77 ; 13.83,7.72 v1(13.53,7.42) ; v1(22.47,10.87) 22.47,10.9 22.98,11.4 U1.24 ; Q1.4 14.38,10.2 13.89,9.7
  Bottom Layer w0.254: v1(22.47,10.87) 21.96,10.36 21.96,9.09 21.1,8.23 14.34,8.23 v1(13.53,7.42)
$1N2211: length 14.6
  Top Layer w0.254: v1(13.23,8.28) 12.69,8.81 Q2.4 ; U1.22 21.9,12.4 v1(21.86,12.44)
  Bottom Layer w0.254: v1(13.23,8.28) 13.73,8.79 21.1,8.79 21.51,9.19 21.51,11.94 21.86,12.29 v1(21.86,12.44)
$1N2235: length 21.8
  Top Layer w0.254: U1.19 22.56,13.9 v1(22.47,13.82) ; Q4.4 8.88,7.29 v1(8.2,7.97)
  Bottom Layer w0.254: v1(8.2,7.97) 8.75,7.42 12.46,7.42 12.62,7.57 12.62,8.79 13.22,9.39 20.74,9.39 21.1,9.75 21.1,12.55 22.37,13.82 v1(22.47,13.82)
$1N2246: length 24.2
  Top Layer w0.254: v1(24.96,16.66) 24.72,16.42 U1.17 ; Q3.4 14.69,3.71 v1(13.78,3.71)
  Bottom Layer w0.254: v1(24.96,16.66) 24.96,11.33 22.88,9.24 22.88,8.43 21.4,6.96 15.41,6.96 13.58,5.13 13.58,3.81
$1N2287: length 2.4
  Top Layer w0.254: U1.2 24.72,8.89 C2.2
$1N2321: length 2.6
  Top Layer w0.254: U1.4 25.72,9.96 26.13,9.55 26.13,8.32
$1N2324: length 4.4
  Top Layer w0.254: C5.1 25.82,6.92 25.22,7.52 U1.3
$1N2619: length 9.4
  Top Layer w0.254: 27.23,10.71 27.33,10.62 v1(28.21,10.62) ; 27.23,10.71 U1.6 28.08,9.34 C6.2 ; 27.23,10.71 27.42,10.9 U1.7 ; 28.31,13.61 28.02,13.9 U1.12
  Bottom Layer w0.254: v1(28.36,13.66) 28.36,10.77 v1(28.21,10.62)
$1N3409: length 11.5
  Top Layer w0.254: 51.83,9.09 52.29,9.55 v1(52.29,9.75) ; U3.24 43.67,6.78 44.11,7.21 v1(44.16,7.16)
  Bottom Layer w0.254: v1(44.16,7.16) 44.16,7.42 46.7,9.95 51.63,9.95 51.83,9.75 v1(52.29,9.75)
$1N3414: length 13.6
  Top Layer w0.254: Q6.4 53.64,9.78 v1(53.46,9.95) ; v1(44.87,5.33) 44.39,5.33 44.37,5.32 U3.22
  Bottom Layer w0.254: v1(44.87,5.33) 46.7,7.16 52.34,7.16 53.46,8.28 v1(53.46,9.95)
$1N3434: length 18
  Top Layer w0.254: Q8.4 57.34,10.44 v1(56.91,10.01) ; v1(44.01,3.2) 44.01,3.48 U3.19
  Bottom Layer w0.254: v1(44.01,3.2) 44.26,3.2 47.57,6.5 52.49,6.5 55.64,9.65 56.56,9.65 v1(56.91,10.01)
$1N3439: length 33.2
  Top Layer w0.254: U3.17 42.47,2.4 v1(42.99,1.88) ; v1(51.99,16.36) 51.78,16.15 Q7.4
  Bottom Layer w0.254: v1(51.99,16.36) 52.34,16 52.34,11.38 52.78,10.95 57.73,10.95 58.13,10.54 58.13,9.35 57.57,8.79 55.95,8.79 52.54,5.38 47.82,5.38 44.37,1.93 43.04,1.93 v1(42.99,1.88)
$1N3449: length 3
  Top Layer w0.254: U3.2 42.47,8.24 41.53,9.18 C9.2
$1N3451: length 3.7
  Top Layer w0.254: U3.4 41.47,7.82 41.11,8.18 40.5,8.18 39.54,9.14 C11.2
$1N3453: length 5.8
  Top Layer w0.254: C11.1 40.52,10.96 40.56,10.92 40.56,8.84 40.86,8.53 41.32,8.53 41.97,7.88 U3.3
$1N3466: length 9.2
  Top Layer w0.254: U3.6 40.47,7.01 40.15,7.01 39.78,6.64 U3.7 39.06,6.32 v1(38.79,6.59) 38.67,6.59 37.66,7.6 37.66,9.48 ; U3.12 39.17,3.82 v1(38.88,4.11)
  Bottom Layer w0.254: v1(38.79,6.59) 38.88,6.5 v1(38.88,4.11)
$1N3933: length 3.1
  Top Layer w0.254: LED1.2 26.7,1.14
$1N4439: length 2.3
  Top Layer w0.254: R7.2 48.62,1.35
$1N4849: length 11.3
  Top Layer w0.254: C3.2 28.1,4.32 D4.1 24.62,4.32 22.94,5.99 C1.2 C2.1 22.94,8.78 24.22,10.06 U1.1
$1N4857: length 10.9
  Top Layer w0.254: C10.2 42.03,13.71 42.93,12.81 42.93,7.01

## Copper pours and planes (outline as drawn; the poured copper is in the pictures)
GND on Top Layer: -4.5,30.07 65.09,30.07 67.89,27.28 67.89,1.37 64.84,-1.68 -2.62,-1.68 -4.5,0.2
GND on Top Layer: 8.43,9.39 11.93,9.39 11.93,8.3 12.26,7.97 12.87,7.97 13.02,7.82 13.02,6.67 12.9,6.55 9.62,6.55 9.62,7.87 8.81,7.87 8.45,8.23 8.45,8.33 8.43,8.34
GND on Top Layer: 53.2,11.94 56.56,11.94 56.56,10.21 56.91,9.85 57.66,9.85 57.76,9.75 57.76,8.49 57.75,8.48 54.58,8.48 54.58,10.06 54.02,10.62 53.2,10.62
GND on Bottom Layer: -6.54,29.67 63.06,29.67 65.85,26.87 65.85,0.96 62.81,-2.08 -4.1,-2.08 -6.54,0.35
LA on Top Layer: 15.31,10.87 13.73,10.87 12.64,9.78 8.26,9.78 8.26,12.4 7.46,13.21 2,13.21 2,16.31 2.25,16.56 7.33,16.56 8.92,14.97 14.44,14.97 15.31,14.42
LA on Bottom Layer: 2,16.31 2.25,16.56 7.33,16.56 8.92,14.97 14.41,14.97 15.31,14.07 15.31,10.87 13.73,10.87 12.62,9.75 9.31,9.75 8.04,11.02 8.04,12.75 7.59,13.2 2,13.2
LB on Top Layer: 15.31,4.62 15.31,7.97 14.39,7.97 12.82,6.4 12.82,6.2 7.84,6.2 7.84,8.99 6.27,10.56 2.75,10.56 1.95,9.76 1.95,4.52 6.57,4.52 7.79,3.3 7.79,0.91 12.76,0.91 13.12,1.27 13.12,3.85 13.89,4.62
LB on Bottom Layer: 13.12,1.27 12.77,0.91 7.79,0.91 7.79,3.3 6.57,4.52 1.95,4.52 1.95,9.75 2.76,10.56 6.27,10.56 7.84,9 7.84,6.2 12.86,6.2 13.12,5.93
RA on Top Layer: 50.92,4.93 51.27,4.93 53.2,3 57.62,3 59.2,4.57 64.28,4.57 64.28,11.03 58.4,11.03 58.4,8.34 57.78,7.72 52.85,7.72 52.19,8.38 50.92,8.38
RA on Bottom Layer: 53.26,3 57.68,3 59.25,4.57 64.28,4.57 64.28,11.02 59,11.02 59,8.69 58.03,7.72 56.28,7.72 53.26,4.7 53.26,3
RB on Top Layer: 51.12,14.78 52.34,14.78 53.26,15.7 53.26,17.49 63.62,17.49 64.28,16.83 64.28,13 58.23,13.06 57.94,12.77 53.23,12.77 52.52,12.06 52.52,11.4 51.12,11.4
RB on Bottom Layer: 53.26,17.48 63.62,17.48 64.28,16.81 64.28,13.04 58.49,13.04 58.23,13.05 57.87,12.7 53.31,12.7 53.26,12.75
VM on Top Layer: 51.36,16.01 51.36,4.82 46.53,4.82 46.53,12.44 45.99,12.99 43.73,12.99 43.73,14.69 45.76,14.69 46.5,15.43 46.5,16.1 51.28,16.1
VM on Top Layer: 11.55,20.17 20.19,20.17 20.19,16.81 19.02,15.64 11.5,15.64 11.5,20.12
VM on Top Layer: 21.25,5.08 23.23,5.08 23.49,4.82 23.49,3.25 16.07,3.25 16.07,17.07 20.16,21.16 21.99,21.16 21.99,24.2 22.83,25.04 26.23,25.04 26.64,24.64 26.64,19.1 25.11,17.58 22.52,17.58 20.85,15.9 20.85,5.24 21.05,5.03 21.21,5.03
VM on Bottom Layer: 22.32,21.18 20.19,21.18 19.17,20.17 19.17,20.17 11.54,20.17 11.54,17.55 22.47,17.55 22.47,21.03
VM on Bottom Layer: 21.99,24.16 22.83,25 22.83,25.04 26.23,25.04 26.64,24.64 26.64,23.19 27.57,22.26 43.88,22.26 46.78,19.35 50.31,19.35 50.31,11.01 50.11,10.82 45.43,10.82 45.43,15.9 42.92,18.41 33.61,18.41 33.11,18.91 28.22,18.9 26.93,17.62 22.07,17.57

## Text on the board
Top Silkscreen Layer: 2DIR | 1DIR | 2PWM | 1PWM | 电源 | 使能
